# Altium schematic sheet audio_codec.SchDoc
size A4
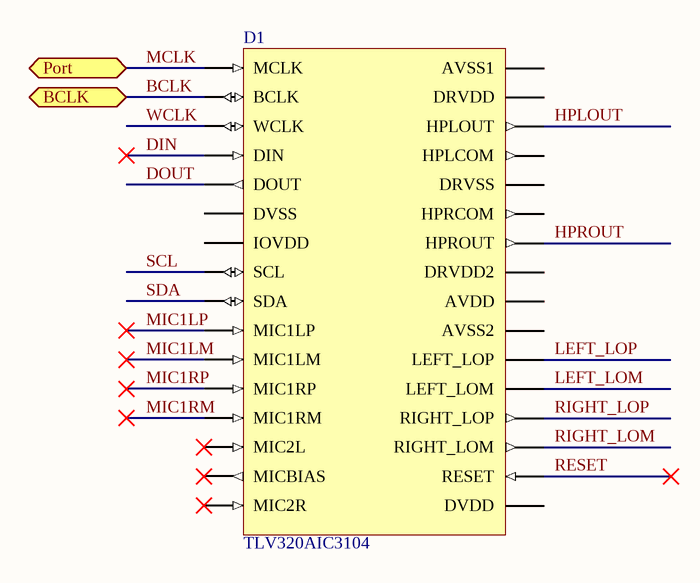
[diagram p0: audio_codec.SchDoc]

## Parts
D1  TLV320AIC3104  [QUAD32-RHB]

## Ports
BCLK (bidir), Port

## Nets
BCLK: D1.2(BCLK) ; port BCLK
DIN: D1.4(DIN)
DOUT: D1.5(DOUT)
HPLOUT: D1.19(HPLOUT)
HPROUT: D1.23(HPROUT)
LEFT_LOM: D1.28(LEFT_LOM)
LEFT_LOP: D1.27(LEFT_LOP)
MCLK: D1.1(MCLK) ; port Port
MIC1LM: D1.11(MIC1LM)
MIC1LP: D1.10(MIC1LP)
MIC1RM: D1.13(MIC1RM)
MIC1RP: D1.12(MIC1RP)
RESET: D1.31(RESET)
RIGHT_LOM: D1.30(RIGHT_LOM)
RIGHT_LOP: D1.29(RIGHT_LOP)
SCL: D1.8(SCL)
SDA: D1.9(SDA)
WCLK: D1.3(WCLK)

Not connected (* = marked no-connect by the designer): D1 6(DVSS) 7(IOVDD) 14(MIC2L)* 15(MICBIAS)* 16(MIC2R)* 17(AVSS1) 18(DRVDD) 20(HPLCOM) 21(DRVSS) 22(HPRCOM) 24(DRVDD2) 25(AVDD) 26(AVSS2) 32(DVDD)